# EAGLE design crazyflie_radio_2.0 (EAGLE 7.4.0)
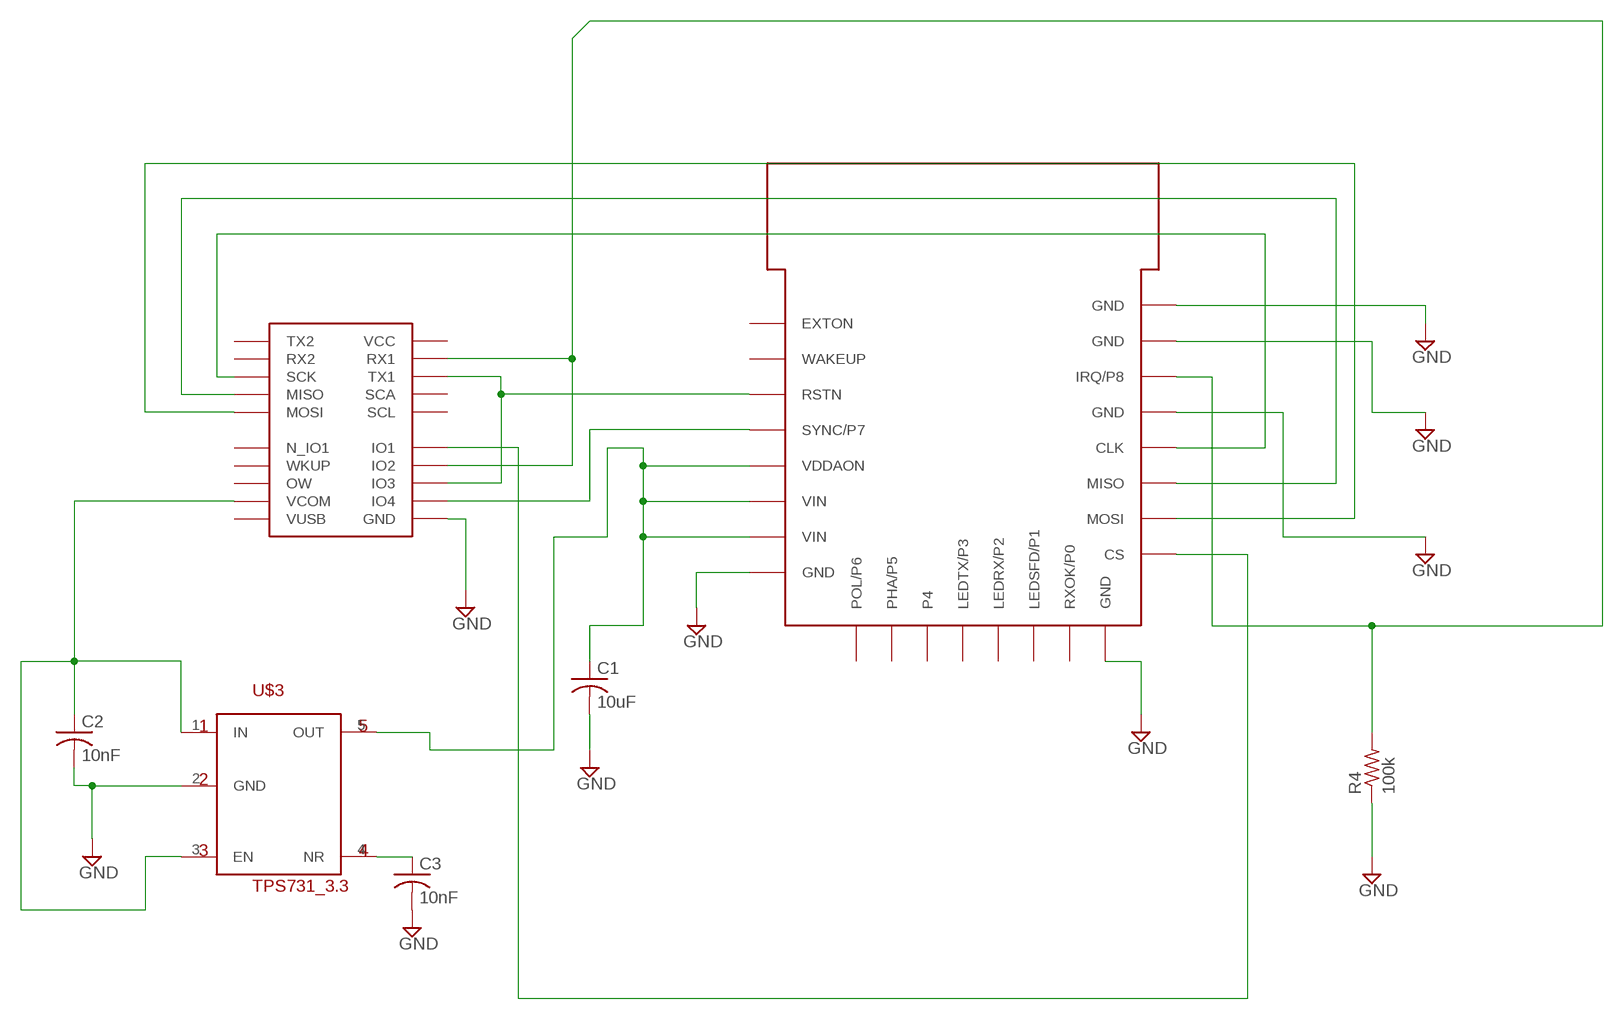
[diagram p0: schematic, sheet 1]

## Parts
C1  10uF  C-USC0402  [C0402]
C2  10nF  C-USC0402  [C0402]
C3  10nF  C-USC0402  [C0402]
R4  100k  R-US_R0402  [R0402]
U$1  DWM100  [DWMPAC]
U$2  CFHEAD  [CFHEADPAC]
U$3  TPS731_3.3  [SOT-23-5]

## Nets
GND: C1.2 C2.2 C3.2 R4.1 U$1.GND@1(GND) U$1.GND@2(GND) U$1.GND@3(GND) U$1.GND@4(GND) U$1.GND@5(GND) U$2.GND U$3.2(GND)
N$1: U$1.SYNC/P7 U$2.IO4
N$2: U$1.MISO U$2.MISO
N$3: U$1.MOSI U$2.MOSI
N$4: U$1.CLK U$2.SCK
N$5: C2.1 U$2.VCOM U$3.1(IN) U$3.3(EN)
N$6: U$1.CS U$2.IO1
N$7: U$1.RSTN U$2.IO3 U$2.TX1
N$10: R4.2 U$1.IRQ/P8 U$2.IO2 U$2.RX1
N$11: C1.1 U$1.VDDAON U$1.VIN@1(VIN) U$1.VIN@2(VIN) U$3.5(OUT)
N$18: C3.1 U$3.4(NR)
Unconnected: U$1.EXTON U$1.LEDRX/P2 U$1.LEDSFD/P1 U$1.LEDTX/P3 U$1.P4 U$1.PHA/P5 U$1.POL/P6 U$1.RXOK/P0 U$1.WAKEUP U$2.N_IO1 U$2.OW U$2.RX2 U$2.SCA U$2.SCL U$2.TX2 U$2.VCC U$2.VUSB U$2.WKUP

## Library data of the parts
C1-C3 = rcl:C-US: CAPACITOR, American symbol
R4 = resistor:R-US_: RESISTOR, American symbol
U$1 = decawave:DWM100
U$2 = decawave:CFHEAD
U$3 = smd-footprints:TPS731_3.3

## Board
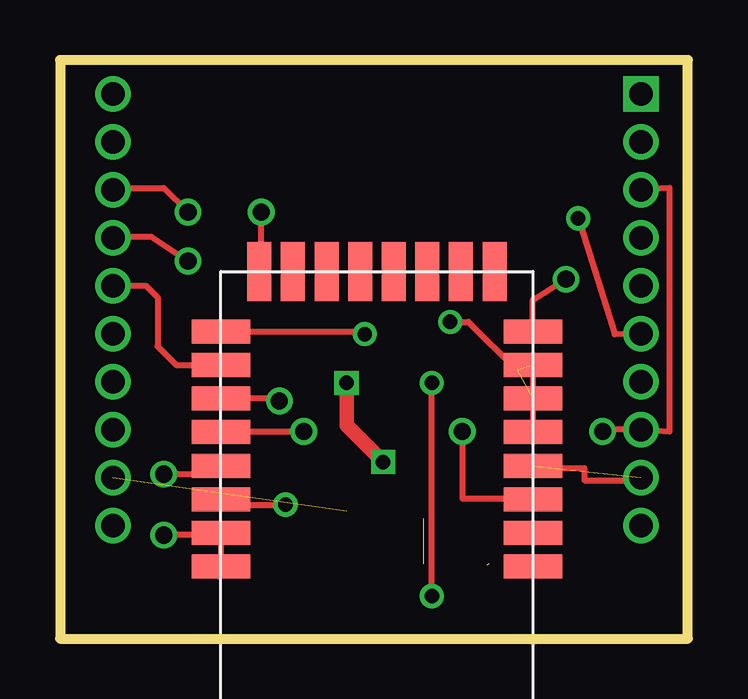
[diagram p1: board, top side]
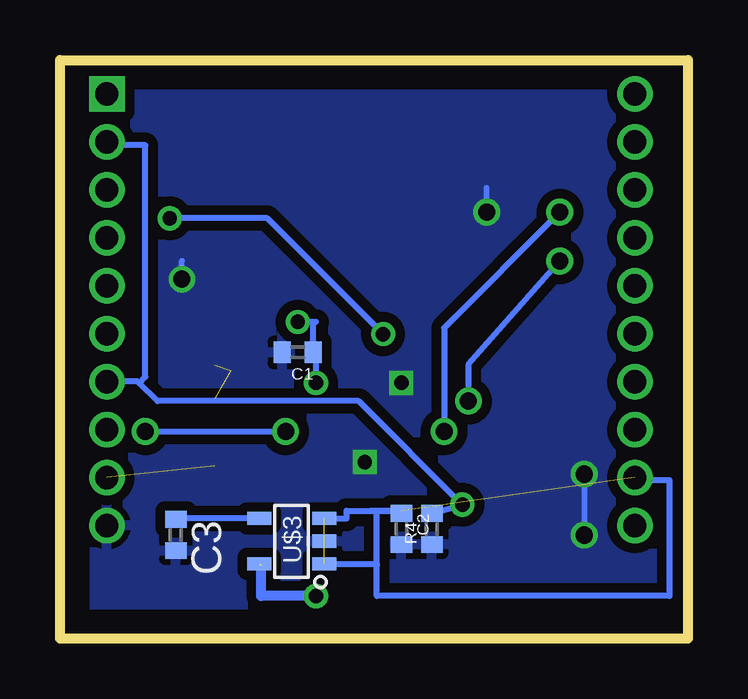
[diagram p2: board, bottom side, seen from below]

Size 26.16 x 24.13 mm. Coordinates in mm from the lower left corner, seen from the top.
Outline: 0,24.13 0,0 26.16,0 26.16,24.13 0,24.13
Copper layers (1*16): Top 0.035mm / dielectric 1.5mm / Bottom 0.035mm
Design rules "default": minimum track width 10mil, minimum drill 24mil, track to track 8mil, track to pad 8mil, pad to pad 8mil, via to via 8mil, smd to smd 8mil, copper to edge 40mil, drill to drill 8mil, minimum pad ring 10mil, minimum via ring 8mil, stop-mask expansion 4mil, vias tented up to drill 0mil, thermal gap 10mil

### Footprints (pad centres in the part's own frame; a part is rotated, then mirrored left to right if it is on the bottom)
C0402 = smd 0.7 x 0.9: 1 -0.65,0; 2 0.65,0
R0402 = smd 0.7 x 0.9: 1 -0.65,0; 2 0.65,0
DWMPAC = smd 2.45 x 1: CLK 6.5,-4.8; CS 6.5,-9; EXTON -6.5,0.8; GND@1 -6.5,-9; GND@3 6.5,-3.4; GND@4 6.5,-0.6; GND@5 6.5,0.8; IRQ/P8 6.5,-2; MISO 6.5,-6.2; MOSI 6.5,-7.6; RSTN -6.5,-2; SYNC/P7 -6.5,-3.4; VDDAON -6.5,-4.8; VIN@1 -6.5,-6.2; VIN@2 -6.5,-7.6; WAKEUP -6.5,-0.6 | smd 1 x 2.45: GND@2 4.9,-11.5; LEDRX/P2 0.7,-11.5; LEDSFD/P1 2.1,-11.5; LEDTX/P3 -0.7,-11.5; P4 -2.1,-11.5; PHA/P5 -3.5,-11.5; POL/P6 -4.9,-11.5; RXOK/P0 3.5,-11.5
CFHEADPAC = drill 0.965 pad 1.414: GND 11,-9; IO1 11,-1; IO2 11,-3; IO3 11,-5; IO4 11,-7; MISO -11,3; MOSI -11,1; N_IO1 -11,-1; OW -11,-5; RX1 11,7; RX2 -11,7; SCA 11,3; SCK -11,5; SCL 11,1; TX1 11,5; TX2 -11,9; VCOM -11,-7; VUSB -11,-9; WKUP -11,-3 | drill 0.965 pad 1.414 square: VCC 11,9
SOT-23-5 = smd 1 x 0.55: 1 -1.35,0.95; 2 -1.35,0; 3 -1.35,-0.95; 4 1.35,-0.95; 5 1.35,0.95

### Placement (x,y rotation side)
C1  16.26,11.94 180 bottom
C2  11.94,4.57 270 bottom
C3  21.34,4.32 270 bottom
R4  10.67,4.57 90 bottom
U$1  13.21,3.81 180 top
U$2  13.21,13.72 0 top
U$3  16.51,4.06 180 bottom

### Tracks (layer width: path | path; a pad name or v marks a point on that pad's centre or on a via)
GND  (via drill 0.6, 0.71)
  Top 0.254: 6.62,2.59 U$1.GND@5 U$1.GND@4 6.55,4.32 v4.32,4.32 | U$1.GND@2 8.31,15.67 8.38,15.75 v8.38,17.78 | U$1.GND@3 6.55,6.86 v4.32,6.86 | U$1.GND@1 19.71,14.12 v21.08,14.99
  Top 0.61: v13.46,7.37 11.94,8.89 v11.94,10.67
  Bottom 0.254: v8.38,17.78 8.38,18.8 | 4.32,4.83 v4.32,4.32 v4.32,6.86 | v21.08,14.99 21.08,15.75
  pour Bottom (isolate 0.406): 0,24.38 0,-0.25 26.16,0 26.16,24.64
N$1  (1 unrouted)
N$2  (via drill 0.71)
  Top 0.254: U$2.MISO 2.26,16.76 3.81,16.76 v5.33,15.75 | v9.14,9.91 9.04,10.01 U$1.MISO
  Bottom 0.254: v5.33,15.75 9.14,11.43 v9.14,9.91
N$3
  Top 0.254: U$2.MOSI 3.57,14.72 4.06,14.22 4.06,12.19 4.85,11.41 U$1.MOSI
N$4  (via drill 0.71)
  Top 0.254: U$2.SCK 2.29,18.8 4.32,18.8 v5.33,17.78 | v10.16,8.64 10.13,8.61 U$1.CLK
  Bottom 0.254: v5.33,17.78 10.16,12.95 v10.16,8.64
N$5  (2 unrouted)
  Bottom 0.254: U$3.3 14.22,5.01 14.22,5.33 11.94,5.33 C2.1 | U$3.1 12.95,3.11 12.95,3.05
N$6  (via drill 0.6 pad 0.61)
  Top 0.254: U$1.CS 12.7,12.81 v12.7,12.7 | v21.59,17.53 23.11,12.7 U$2.IO1
  Bottom 0.254: v12.7,12.7 17.53,17.53 v21.59,17.53
N$7  (via drill 0.71)
  Top 0.254: 19.68,5.84 U$1.RSTN 19.71,5.84 16.76,5.84 v16.76,8.64 | v22.61,8.64 22.61,8.72 U$2.IO3 25.4,8.64 25.4,18.8 U$2.TX1
  Bottom 0.254: v22.61,8.64 v16.76,8.64
N$10  (via drill 0.6 pad 0.61)
  Top 0.254: U$1.IRQ/P8 6.93,5.59 v9.4,5.59
  Bottom 0.254: 22.86,10.67 22.1,9.91 13.72,9.91 v9.4,5.59 R4.2 | 22.86,10.67 22.91,10.72 U$2.IO2 | 22.86,10.67 22.61,10.92 22.61,20.57 24.21,20.57 U$2.RX1
N$11  (via drill 0.6 pad 0.61)  (3 unrouted)
  Top 0.254: v15.49,1.78 v15.49,10.67 | v16.26,13.21 17.02,13.21 19.05,11.18 | U$1.VIN@2 U$1.VDDAON
  Bottom 0.254: v15.49,10.67 15.49,11.94 C1.1 15.61,13.21 | 15.61,13.21 15.49,13.21 | 15.61,13.21 v16.26,13.21
  Bottom 0.406: v15.49,1.78 17.78,1.78 17.78,3.05
N$16
  Bottom 0.254: 2.29,6.6 0.76,6.6 0.76,1.78 12.95,1.78 12.95,5.33 | 12.19,5.33 12.95,5.33 | 12.95,5.33 13.21,5.33
N$17
  Top 0.254: 20.57,7.11 21.84,7.11 21.84,6.6 24.13,6.6
N$18
  Bottom 0.254: U$3.4 21.34,5.01 C3.1